# EAGLE design SolarBase731-v00 (EAGLE 5.10)
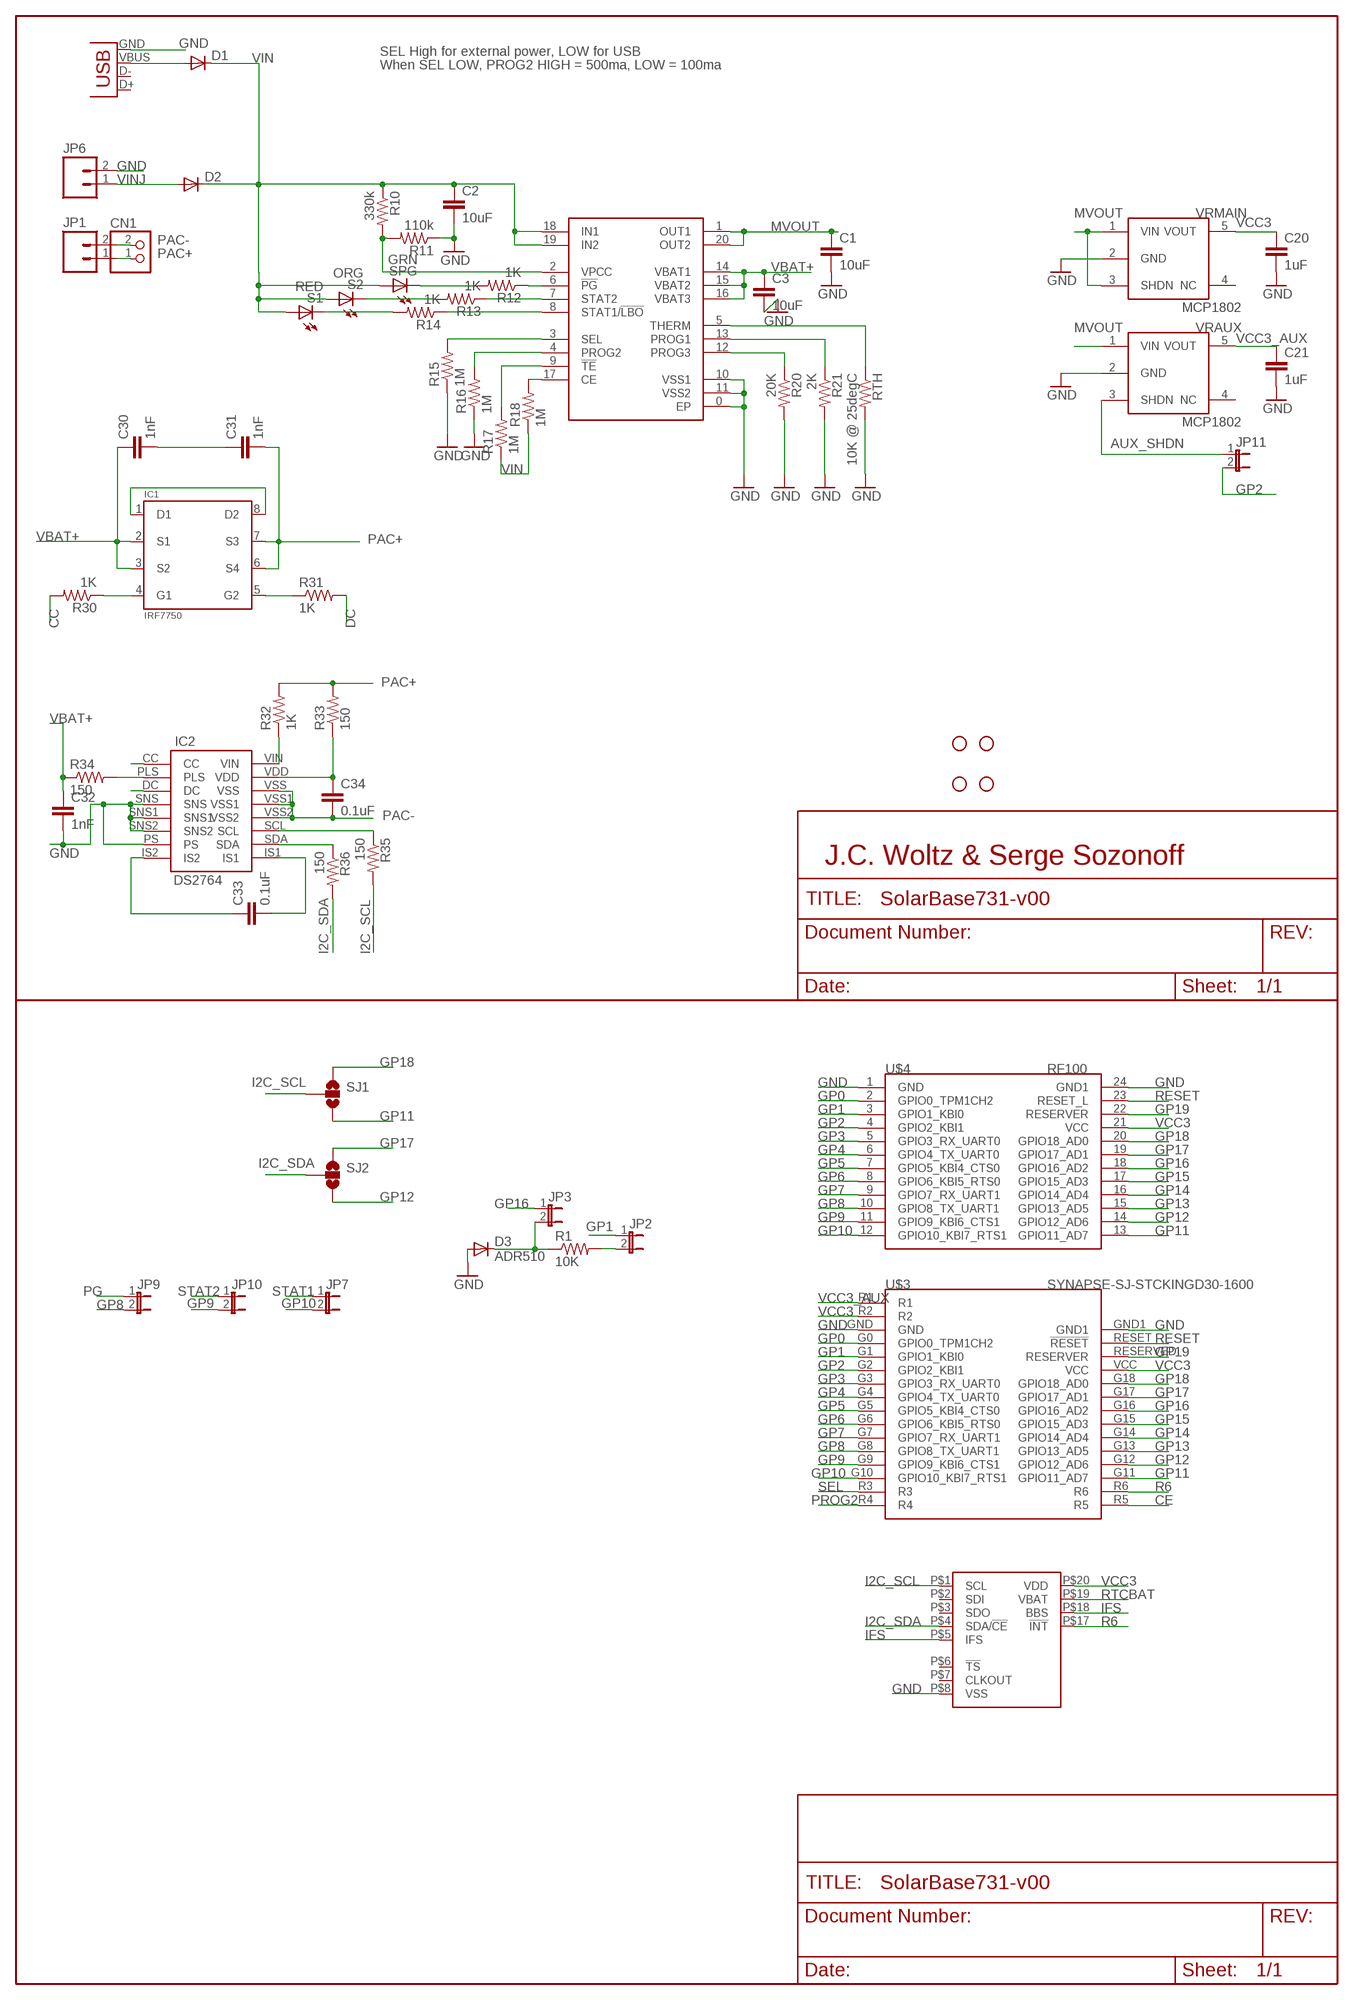
[diagram p0: schematic, sheet 1]

## Parts
C1  10uF  CAP1206  [1206]
C2  10uF  CAP1206  [1206]
C3  10uF  CAP1206  [1206]
C20  1uF  CAP0603-CAP  [0603-CAP]
C21  1uF  CAP0603-CAP  [0603-CAP]
C30  1nF  CAP0603-CAP  [0603-CAP]
C31  1nF  CAP0603-CAP  [0603-CAP]
C32  1nF  CAP0603-CAP  [0603-CAP]
C33  0.1uF  CAP0603-CAP  [0603-CAP]
C34  0.1uF  CAP0603-CAP  [0603-CAP]
CN1  JST_2PIN-THM-RA  [JST-PH-2-THM-RA]
D1  DIODESOD  [SOD-323]
D2  DIODESMA  [SMA-DIODE]
D3  ADR510  DIODESOT-23-3-ADR510  [SOT23-3]
IC1  IRF7750  [TSSOP8-4.4MM]
IC2  DS2764  [DS2764]
JP1  M02PTH  [1X02]
JP2  JUMPER-2SMD-NC  [SJ_2S]
JP3  JUMPER-2SMD-NC  [SJ_2S]
JP4  STAND-OFF  [STAND-OFF]
JP5  STAND-OFF  [STAND-OFF]
JP6  M023.5MM  [SCREWTERMINAL-3.5MM-2]
JP7  JUMPER-2SMD-NC  [SJ_2S]
JP9  JUMPER-2SMD-NC  [SJ_2S]
JP10  JUMPER-2SMD-NC  [SJ_2S]
JP11  JUMPER-2SMD-NC  [SJ_2S]
JP12  STAND-OFF  [STAND-OFF]
JP17  STAND-OFF  [STAND-OFF]
R1  10K  RESISTOR0603-RES  [0603-RES]
R10  330k  RESISTOR0603-RES  [0603-RES]
R11  110k  RESISTOR0603-RES  [0603-RES]
R12  1K  RESISTOR0603-RES  [0603-RES]
R13  1K  RESISTOR0603-RES  [0603-RES]
R14  1K  RESISTOR0603-RES  [0603-RES]
R15  1M  RESISTOR0603-RES  [0603-RES]
R16  1M  RESISTOR0603-RES  [0603-RES]
R17  1M  RESISTOR0603-RES  [0603-RES]
R18  1M  RESISTOR0603-RES  [0603-RES]
R20  20K  RESISTOR0603-RES  [0603-RES]
R21  2K  RESISTOR0603-RES  [0603-RES]
R30  1K  RESISTOR0603-RES  [0603-RES]
R31  1K  RESISTOR0603-RES  [0603-RES]
R32  1K  RESISTOR0603-RES  [0603-RES]
R33  150  RESISTOR0603-RES  [0603-RES]
R34  150  RESISTOR0603-RES  [0603-RES]
R35  150  RESISTOR0603-RES  [0603-RES]
R36  150  RESISTOR0603-RES  [0603-RES]
RTH  10K @ 25degC  RESISTOR0603-RES  [0603-RES]
S1  RED  LED0603  [LED-0603]
S2  ORG  LED0603  [LED-0603]
SJ1  SOLDERJUMPER_2WAYS  [SJ_3]
SJ2  SOLDERJUMPER_2WAYS  [SJ_3]
SPG  GRN  LED0603  [LED-0603]
U$1  PCF2129ASO20  [SO20W]
U$2  MCP73871  MCP73871QFNE  [QFN20]
U$3  SYNAPSE-SJ-STCKINGD30-1600  [SYNSJ-STACK]
U$4  SYNAPSEWIRELESS-RFENGINESTD  SYNAPSEWIRELESS-RFENGINESTDTHM  [SYNAPSERFENGINE-THM]
VRAUX  MCP1802  [SOT23-5]
VRMAIN  MCP1802  [SOT23-5]
X1  USBSMD  [USB-MINIB]

## Nets
!TE: R17.2 U$2.9(!TE)
AUX_SHDN: JP11.1 VRAUX.3(SHDN)
CC: IC2.CC R30.2
CE: R18.2 U$2.17(CE) U$3.R5
DC: IC2.DC R31.2
GND: C1.2 C2.2 C3.2 C20.2 C21.2 C32.2 D3.2(A) IC2.PS IC2.SNS IC2.SNS1 IC2.SNS2 JP6.2 R11.1 R15.1 R16.1 R20.2 R21.2 RTH.2 U$1.P$8(VSS) U$2.0(EP) U$2.10(VSS1) U$2.11(VSS2) U$3.GND U$3.GND1 U$4.1(GND) U$4.24(GND1) VRAUX.2(GND) VRMAIN.2(GND) X1.GND
GP0: U$3.G0(GPIO0_TPM1CH2) U$4.2(GPIO0_TPM1CH2)
GP1 [small_sig]: JP2.1 U$3.G1(GPIO1_KBI0) U$4.3(GPIO1_KBI0)
GP2 [small_sig]: JP11.2 U$3.G2(GPIO2_KBI1) U$4.4(GPIO2_KBI1)
GP3 [small_sig]: U$3.G3(GPIO3_RX_UART0) U$4.5(GPIO3_RX_UART0)
GP4 [small_sig]: U$3.G4(GPIO4_TX_UART0) U$4.6(GPIO4_TX_UART0)
GP5 [small_sig]: U$3.G5(GPIO5_KBI4_CTS0) U$4.7(GPIO5_KBI4_CTS0)
GP6 [small_sig]: U$3.G6(GPIO6_KBI5_RTS0) U$4.8(GPIO6_KBI5_RTS0)
GP7 [small_sig]: U$3.G7(GPIO7_RX_UART1) U$4.9(GPIO7_RX_UART1)
GP8 [small_sig]: JP9.2 U$3.G8(GPIO8_TX_UART1) U$4.10(GPIO8_TX_UART1)
GP9 [small_sig]: JP10.2 U$3.G9(GPIO9_KBI6_CTS1) U$4.11(GPIO9_KBI6_CTS1)
GP10 [small_sig]: JP7.2 U$3.G10(GPIO10_KBI7_RTS1) U$4.12(GPIO10_KBI7_RTS1)
GP11 [small_sig]: SJ1.3 U$3.G11(GPIO11_AD7) U$4.13(GPIO11_AD7)
GP12 [small_sig]: SJ2.3 U$3.G12(GPIO12_AD6) U$4.14(GPIO12_AD6)
GP13 [small_sig]: U$3.G13(GPIO13_AD5) U$4.15(GPIO13_AD5)
GP14 [small_sig]: U$3.G14(GPIO14_AD4) U$4.16(GPIO14_AD4)
GP15 [small_sig]: U$3.G15(GPIO15_AD3) U$4.17(GPIO15_AD3)
GP16 [small_sig]: JP3.1 U$3.G16(GPIO16_AD2) U$4.18(GPIO16_AD2)
GP17 [small_sig]: SJ2.1 U$3.G17(GPIO17_AD1) U$4.19(GPIO17_AD1)
GP18 [small_sig]: SJ1.1 U$3.G18(GPIO18_AD0) U$4.20(GPIO18_AD0)
GP19 [small_sig]: U$3.RESERVED(RESERVER) U$4.22(RESERVER)
I2C_SCL [small_sig]: R35.2 SJ1.2 U$1.P$1(SCL)
I2C_SDA [small_sig]: R36.2 SJ2.2 U$1.P$4(SDA/!CE)
IFS: U$1.P$5(IFS) U$1.P$18(BBS)
MVOUT: C1.1 U$2.1(OUT1) U$2.20(OUT2) VRAUX.1(VIN) VRMAIN.1(VIN) VRMAIN.3(SHDN)
N$1: IC1.1(D1) IC1.8(D2)
N$2: R12.2 SPG.C
N$3: D3.1(C) JP3.2 R1.1
N$4: JP2.2 R1.2
N$5: IC1.4(G1) R30.1
N$6: R13.2 S2.C
N$7: R14.2 S1.C
N$14: IC1.5(G2) R31.1
N$15: IC2.VIN R32.1
N$16: C33.2 IC2.IS1
N$17: IC2.SCL R35.1
N$18: C34.1 IC2.VDD R33.1
N$19: C30.2 C31.1
N$21: D1.2(A) X1.VBUS
N$23: R10.2 R11.2 U$2.2(VPCC)
N$24: C33.1 IC2.IS2
N$25: IC2.SDA R36.1
PAC+ [Vbat]: C31.2 CN1.1 IC1.6(S4) IC1.7(S3) JP1.1 R32.2 R33.2
PAC- [Vbat]: C34.2 CN1.2 IC2.VSS IC2.VSS1 IC2.VSS2 JP1.2
PG: JP9.1 R12.1 U$2.6(!PG)
PLS: IC2.PLS R34.2
PROG1: R21.1 U$2.13(PROG1)
PROG2: R16.2 U$2.4(PROG2) U$3.R4
PROG3: R20.1 U$2.12(PROG3)
R6: U$1.P$17(!INT) U$3.R6
RESET [small_sig]: U$3.RESET(!RESET) U$4.23(RESET_L)
RTCBAT: U$1.P$19(VBAT)
SEL: R15.2 U$2.3(SEL) U$3.R3
STAT1: JP7.1 R14.1 U$2.8(STAT1/!LBO)
STAT2: JP10.1 R13.1 U$2.7(STAT2)
THERM: RTH.1 U$2.5(THERM)
VBAT+ [Vbat]: C3.1 C30.1 C32.1 IC1.2(S1) IC1.3(S2) R34.1 U$2.14(VBAT1) U$2.15(VBAT2) U$2.16(VBAT3)
VCC3: C20.1 U$1.P$20(VDD) U$3.R2 U$3.VCC U$4.21(VCC) VRMAIN.5(VOUT)
VCC3_AUX: C21.1 U$3.R1 VRAUX.5(VOUT)
VIN: C2.1 D1.1(C) D2.C R10.1 R17.1 R18.1 S1.A S2.A SPG.A U$2.18(IN1) U$2.19(IN2)
VINJ: D2.A JP6.1
Unconnected: U$1.P$2(SDI) U$1.P$3(SDO) U$1.P$6(!TS) U$1.P$7(CLKOUT) VRAUX.4(NC) VRMAIN.4(NC) X1.D+ X1.D-

## Notes on the sheet
- SEL High for external power, LOW for USB
- When SEL LOW, PROG2 HIGH = 500ma, LOW = 100ma
- J.C. Woltz & Serge Sozonoff

## Library data of the parts
C1-C3 = SparkFun:CAP: Capacitor Standard 0603 ceramic capacitor, and 0.1" leaded capacitor.
C20 C21 C30-C34 = 0_jc-custom:CAP: Capacitor Standard 0603 ceramic capacitor, and 0.1" leaded capacitor.
CN1 = 0_jc-custom:JST_2PIN: JST 2-Pin Connectors of various flavors SMT-RA (S2B-PH-SM4) 4UConnector #17311 SMT (B2B-PH-SM4) THM-RA (S2B-PH) THM (B2B-PH)
D1 D2 = SparkFun:DIODE: Diode These are standard reverse protection diodes and small signal diodes. SMA package can handle up to about 1A. SOD-323 can handle about 200mA. What the SOD-323 package when ordering, there are some mfgs out there that are 5-pin packages.
D3 = 0_jc-modified:DIODE: Diode These are standard reverse protection diodes and small signal diodes. SMA package can handle up to about 1A. SOD-323 can handle about 200mA. What the SOD-323 package when ordering, there are some mfgs out there that are 5-pin packages.
IC1 = ssozonoff:IRF7750: HEXFET® power MOSFETs from International Rectifier utilize advanced processing techniques to achieve extremely low on-resistance per silicon area. This benefit, combined with the ruggedized device design, that International Rectifier is well known for, provides the designer with an extremely efficient and reliable device for battery and load management.
IC2 = ssozonoff:DS2764
JP1 JP6 = SparkFun:M02: Header 2 Standard 2-pin 0.1" header. Use with straight break away headers (SKU : PRT-00116), right angle break away headers (PRT-00553), swiss pins (PRT-00743), machine pins (PRT-00117), and female headers (PRT-00115). Molex polarized connector foot print use with SKU : PRT-08233 with associated crimp pins and housings.
JP2 JP3 JP7 JP9-JP11 = SparkFun:JUMPER-2: Jumper Basic 0.1" spaced jumper. Use with breakaway headers.
JP4 JP5 JP12 JP17 = SparkFun:STAND-OFF: Stand Off This is the mechanical footprint for a #4 phillips button head screw. Use the keepout ring to avoid running the screw head into surrounding components. SKU : PRT-00447
R1 R10-R18 R20 R21 R30-R36 RTH = 0_jc-custom:RESISTOR
S1 S2 SPG = 0_jc-custom:LED: LEDs Standard schematic elements and footprints for 5mm, 3mm, 1206, and 0603 sized LEDs. 5mm - Spark Fun Electronics SKU : COM-00529 (and others)
SJ1 SJ2 = SparkFun:SOLDERJUMPER_2WAY: Solder Jumper 2 way solder jumper
U$1 = 0_jc-custom:PCF2129A
U$2 = 0_jc-custom:MCP73871
U$3 = 0_jc-custom:SYNAPSE-SJ-STCKING: Standard layout for expansion modules using Synapse Wireless boards
U$4 = 0_jc-custom:SYNAPSEWIRELESS-RFENGINE
VRAUX VRMAIN = 0_jc-modified:MCP1802
X1 = 0_jc-custom:USB: USB Connectors USB-B-PTH is fully proven SKU : PRT-00139 USB-miniB is fully proven SKU : PRT-00587 USB-A-PCB is untested. USB-A-H is throughly reviewed, but untested. Spark Fun Electronics SKU : PRT-00437 USB-B-SMT is throughly reviewed, but untested. Needs silkscreen touching up. USB-A-S has not been used/tested USB-MB-H has not been used/tested

## Net classes
0 default: width 0.229 mm
1 Vbat: width 0.483 mm
2 small_sig: width 0.152 mm

## Board
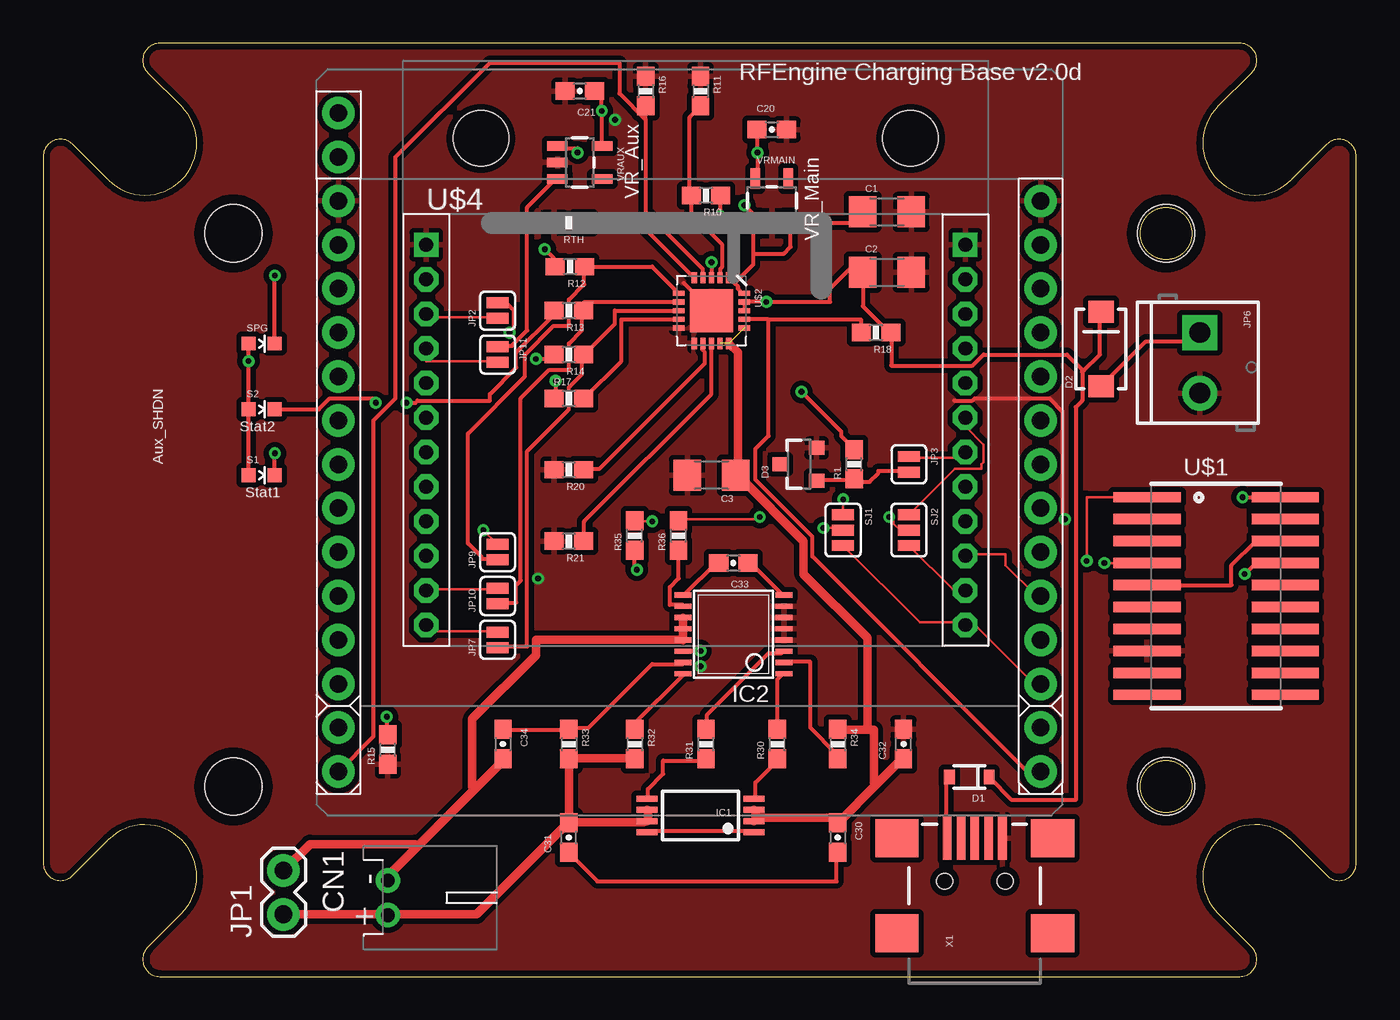
[diagram p1: board, top side]
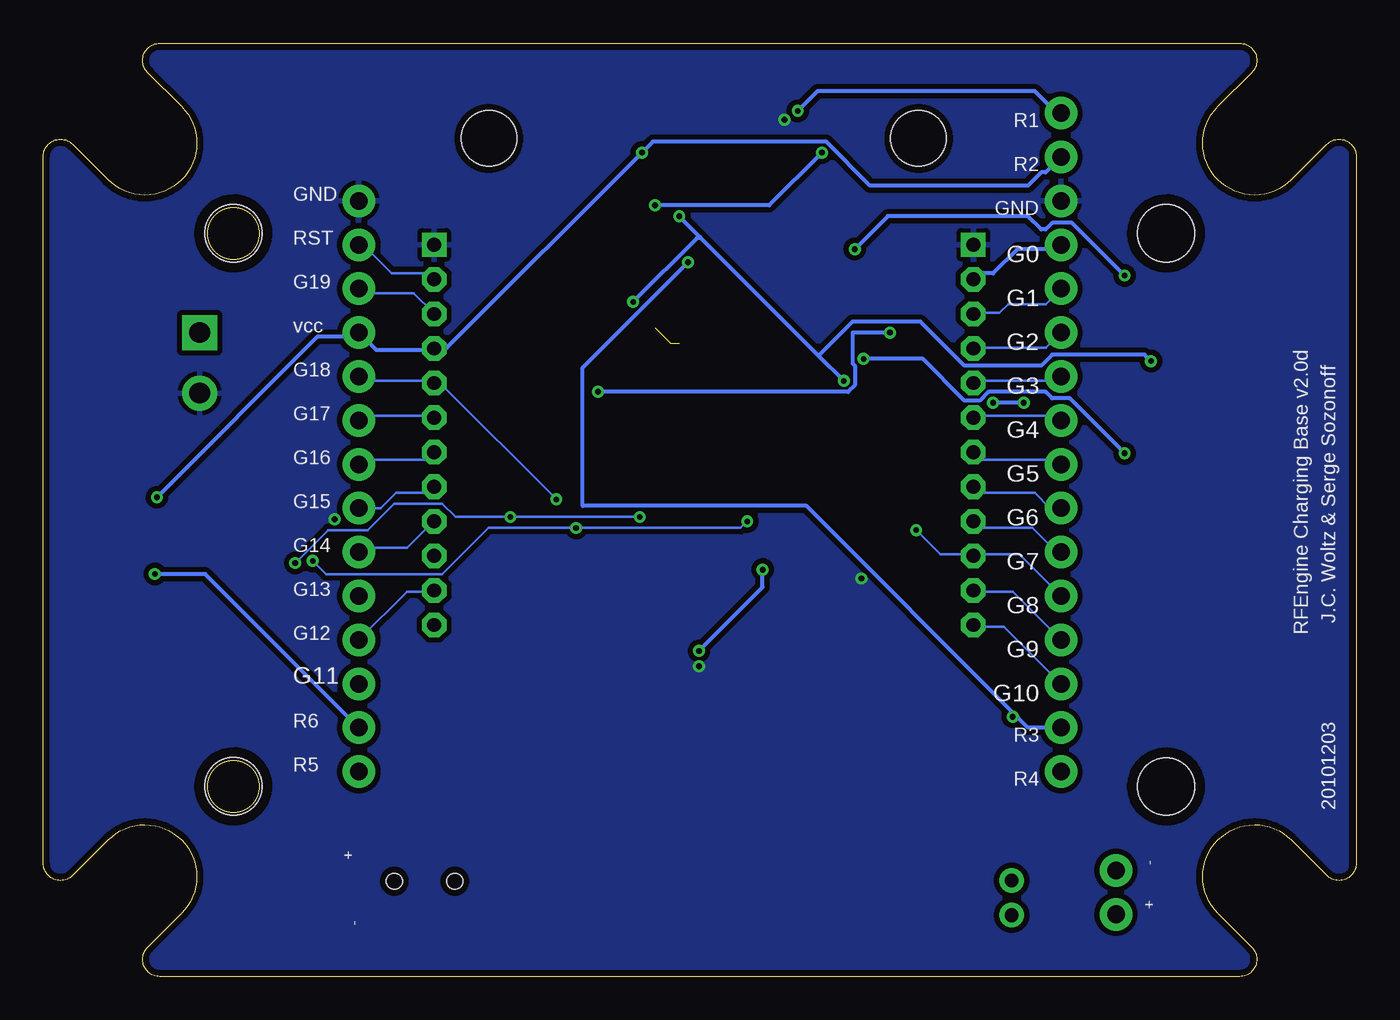
[diagram p2: board, bottom side, seen from below]

Size 76 x 54 mm. Coordinates in mm from the lower left corner, seen from the top.
Outline: 72.24,46.1 arc-180 68,50.34 69.95,52.29 arc135 69.24,54 6.75,54 arc135 6.05,52.29 8,50.34 arc-180 3.76,46.1 1.71,48.15 arc135 0,47.44 0,6.55 arc135 1.71,5.85 3.76,7.9 arc-180 8,3.66 6.05,1.71 arc135 6.75,0 69.24,0 arc135 69.95,1.71 68,3.66 arc-180 72.24,7.9 74.29,5.85 arc135 76,6.55 76,47.44 arc135 74.29,48.15 72.24,46.1
Outline: circle at 64.99,43 radius 1.5
Outline: circle at 64.99,11 radius 1.5
Copper layers (1*16): Top 0.0356mm / dielectric 1.5011mm / Bottom 0.0356mm
Design rules "LaenPCBOrder-JCModified": minimum track width 6mil, minimum drill 13mil, track to track 6mil, track to pad 6mil, pad to pad 6mil, via to via 6mil, smd to smd 6mil, copper to edge 15mil, drill to drill 6mil, minimum pad ring 12mil, minimum via ring 7mil, stop-mask expansion 4mil, vias tented up to drill 25mil, thermal gap 10mil

### Footprints (pad centres in the part's own frame; a part is rotated, then mirrored left to right if it is on the bottom)
1206 = smd 1.6 x 1.8: 1 -1.4,0; 2 1.4,0
0603-CAP = smd 1.1 x 1: 1 -0.85,0; 2 0.85,0
JST-PH-2-THM-RA = drill 0.8 pad 1.422 round: 1 1,0; 2 -1,0
SOD-323 = smd 0.63 x 0.83: 1 -1.15,0; 2 1.15,0
SMA-DIODE = smd 1.27 x 1.47: A -2.15,0; C 2.15,0
SOT23-3 = smd 0.8 x 0.9: 1 -0.95,-1; 2 0.95,-1; 3 0,1.1
TSSOP8-4.4MM = smd 1.2 x 0.35: 1 -3.1,0.975; 2 -3.1,0.325; 3 -3.1,-0.325; 4 -3.1,-0.975; 5 3.1,-0.975; 6 3.1,-0.325; 7 3.1,0.325; 8 3.1,0.975
DS2764 = smd 0.305 x 0.991: CC -2.275,-2.918; DC -0.975,-2.918; IS1 2.275,2.918; IS2 2.275,-2.918; PLS -1.625,-2.918; PS 1.625,-2.918; SCL -0.975,2.918; SDA 1.625,2.918; SNS -0.325,-2.918; SNS1 0.325,-2.918; SNS2 0.975,-2.918; VDD -1.625,2.918; VIN -2.275,2.918; VSS -0.325,2.918; VSS1 0.325,2.918; VSS2 0.975,2.918
1X02 = drill 1.016 pad 1.88 round: 1 0,0; 2 2.54,0
SJ_2S = smd 0.635 x 1.27: 1 -0.45,0; 2 0.45,0
STAND-OFF = hole 3.302: 0,0
SCREWTERMINAL-3.5MM-2 = drill 1.2 pad 2.032 square: 1 0,0 | drill 1.2 pad 2.032 round: 2 3.5,0
0603-RES = smd 1.1 x 1: 1 -0.85,0; 2 0.85,0
LED-0603 = smd 0.8 x 0.8: A 0,-0.75; C 0,0.75
SJ_3 = smd 0.635 x 1.27: 1 -0.889,0; 2 0,0; 3 0.889,0
SO20W = smd 0.6 x 3.9: P$1 -5.715,-4; P$2 -4.445,-4; P$3 -3.175,-4; P$4 -1.905,-4; P$5 -0.635,-4; P$6 0.635,-4; P$7 1.905,-4; P$8 3.175,-4; P$9 4.445,-4; P$10 5.715,-4; P$11 5.715,4; P$12 4.445,4; P$13 3.175,4; P$14 1.905,4; P$15 0.635,4; P$16 -0.635,4; P$17 -1.905,4; P$18 -3.175,4; P$19 -4.445,4; P$20 -5.715,4
QFN20 = smd 2.5 x 2.5: 0 0,0 | smd 0.65 x 0.3: 1 -1.9,1; 2 -1.9,0.5; 3 -1.9,0; 4 -1.9,-0.5; 5 -1.9,-1; 11 1.9,-1; 12 1.9,-0.5; 13 1.9,0; 14 1.9,0.5; 15 1.9,1 | smd 0.3 x 0.65: 6 -1,-1.9; 7 -0.5,-1.9; 8 0,-1.9; 9 0.5,-1.9; 10 1,-1.9; 16 1,1.9; 17 0.5,1.9; 18 0,1.9; 19 -0.5,1.9; 20 -1,1.9
SYNSJ-STACK = drill 1.016 pad 1.88 round: G0 0,-7.62; G1 0,-10.16; G2 0,-12.7; G3 0,-15.24; G4 0,-17.78; G5 0,-20.32; G6 0,-22.86; G7 0,-25.4; G8 0,-27.94; G9 0,-30.48; G10 0,-33.02; G11 40.64,-33.02; G12 40.64,-30.48; G13 40.64,-27.94; G14 40.64,-25.4; G15 40.64,-22.86; G16 40.64,-20.32; G17 40.64,-17.78; G18 40.64,-15.24; GND 0,-5.08; GND1 40.64,-5.08; R1 0,0; R2 0,-2.54; R3 0,-35.56; R4 0,-38.1; R5 40.64,-38.1; R6 40.64,-35.56; RESERVED 40.64,-10.16; RESET 40.64,-7.62; VCC 40.64,-12.7
SYNAPSERFENGINE-THM = drill 0.8 square: 1 0,0; 24 31.2,0 | drill 0.8 pad 1.422 octagon: 2 0,-2; 3 0,-4; 4 0,-6; 5 0,-8; 6 0,-10; 7 0,-12; 8 0,-14; 9 0,-16; 10 0,-18; 11 0,-20; 12 0,-22; 13 31.2,-22; 14 31.2,-20; 15 31.2,-18; 16 31.2,-16; 17 31.2,-14; 18 31.2,-12; 19 31.2,-10; 20 31.2,-8; 21 31.2,-6; 22 31.2,-4; 23 31.2,-2 | hole 3.2: 3.17,6.16; 28.03,6.16
SOT23-5 = smd 0.55 x 1.2: 1 -0.95,-1.3; 2 0,-1.3; 3 0.95,-1.3; 4 0.95,1.3; 5 -0.95,1.3
USB-MINIB = smd 2.5 x 0.5: D+ 2.5,0; D- 2.5,0.8; GND 2.5,-1.6; ID 2.5,-0.8; VBUS 2.5,1.6 | smd 2.2 x 2.5: GND@1 -3,-4.5; GND@2 -3,4.5; GND@3 2.5,4.5; GND@4 2.5,-4.5 | hole 0.9: 0,1.75; 0,-1.75

### Placement (x,y rotation side)
C1  48.84,44.24 0 top
C2  48.84,40.75 0 top
C3  38.68,29 180 top
C20  42.17,49.01 0 top
C21  31.06,51.23 180 top
C30  45.98,8.05 270 top
C31  30.42,8.05 90 top
C32  49.79,13.45 90 top
C33  39.95,23.92 180 top
C34  26.61,13.45 270 top
CN1  19.95,4.56 270 top
D1  53.6,11.54 180 top
D2  61.22,36.31 90 top
D3  43.76,29.64 90 top
IC1  38.04,9.32 180 top
IC2  39.95,19.8 90 top
JP1  13.91,3.6 90 top
JP2  26.3,38.53 90 top
JP3  50.11,29.64 270 top
JP4  64.99,43 0 top
JP5  11.01,43 0 top
JP6  66.94,37.26 270 top
JP7  26.3,19.48 90 top
JP9  26.3,24.56 90 top
JP10  26.3,22.02 90 top
JP11  26.3,35.99 270 top
JP12  64.99,11 0 top
JP17  11.01,11 0 top
R1  46.93,29.64 90 top
R10  38.36,45.2 180 top
R11  38.04,51.23 270 top
R12  30.49,41.07 180 top
R13  30.42,38.53 180 top
R14  30.42,35.99 180 top
R15  19.95,13.13 90 top
R16  34.87,51.23 270 top
R17  30.42,33.45 0 top
R18  48.2,37.26 180 top
R20  30.42,29.32 180 top
R21  30.42,25.19 180 top
R30  42.49,13.45 90 top
R31  38.36,13.45 90 top
R32  34.23,13.45 270 top
R33  30.42,13.45 270 top
R34  45.98,13.45 270 top
R35  34.23,25.51 90 top
R36  36.77,25.51 90 top
RTH  30.42,43.61 180 top
S1  12.64,29 270 top
S2  12.64,32.81 270 top
SJ1  46.3,25.83 270 top
SJ2  50.11,25.83 270 top
SPG  12.64,36.62 270 top
U$1  67.89,22.02 270 top
U$2  38.68,38.53 270 top
U$3  17.09,49.96 0 top
U$4  22.17,42.34 0 top
VRAUX  31.06,47.1 270 top
VRMAIN  42.17,44.88 0 top
X1  53.92,5.51 90 top

### Tracks (layer width: path | path; a pad name or v marks a point on that pad's centre or on a via)
!TE
  Top 0.229: U$2.9 33.47,38.02 33.47,35.61 31.31,33.45 R17.2
AUX_SHDN
  Top 0.229: VRAUX.3 29.66,46.15 28.01,44.5 28.01,37.38 27.12,36.5 26.36,36.5 JP11.1
CC
  Top 0.229: IC2.CC 42.74,17.45 42.49,17.19 42.49,14.4 R30.2
CE
  Top 0.229: 41.98,38.02 47.32,38.02 47.32,37.26 R18.2 | 41.98,38.02 U$2.17 | 41.98,38.02 41.98,31.29 41.22,30.53 41.22,28.75 44.52,25.45 44.52,24.3 56.97,11.86 U$3.R5
DC
  Top 0.229: IC2.DC 42.74,18.72 41.98,18.72 38.43,15.16 38.43,14.4 R31.2
GND  (via drill 0.33)
  Top 0.229: U$2.0 37.16,40.05 37.07,40.13 | v59.13,26.46 59,26.59 59,32.69 58.24,33.45 53.92,33.45 53.79,33.32 52.78,33.32 52.72,33.34
  other vias: 28.65,23.03 38.04,17.95 33.09,49.58
  pour Top (isolate 0.305): -0.69,0.43 -0.69,53.77 75.51,53.77 75.51,0.43
  pour Bottom (isolate 0.305): 0.58,53.77 0.58,0.43 75.51,0.43 75.51,53.77
GP0
  Bottom 0.229: U$3.G0 17.34,42.08 19.63,42.08 21.03,40.69 21.92,40.69 22.17,40.43 U$4.2
GP1
  Top 0.152: JP2.1 26.23,38.15 22.17,38.15 22.17,38.27 U$4.3
  Bottom 0.152: U$3.G1 17.98,38.91 20.14,38.91 20.65,38.4 22.17,38.4 U$4.3
GP2
  Top 0.152: JP11.2 26.23,35.61 22.17,35.61 22.17,36.24 U$4.4
  Bottom 0.152: U$3.G2 17.98,36.37 22.17,36.37 U$4.4
GP3
  Bottom 0.152: U$3.G3 17.34,34.46 22.17,34.46 U$4.5
GP4
  Bottom 0.152: U$3.G4 17.34,32.43 22.17,32.43 U$4.6
GP5
  Bottom 0.152: U$3.G5 17.34,29.89 21.79,29.89 22.17,30.27 U$4.7
GP6
  Bottom 0.152: U$3.G6 17.72,27.1 18.61,27.99 21.92,27.99 22.17,28.24 U$4.8
GP7
  Bottom 0.152: U$3.G7 17.34,24.56 18.74,25.95 21.79,25.95 U$4.9
GP8  (via drill 0.33)
  Top 0.152: v25.47,25.83 26.23,25.07 JP9.2
  Bottom 0.152: v25.47,25.83 24.07,24.43 22.17,24.43 | 22.17,24.43 U$4.10 22.17,24.43 | U$3.G8 19.5,24.43 22.17,24.43
GP9
  Top 0.152: JP10.2 26.23,22.4 22.17,22.4 U$4.11
  Bottom 0.152: U$3.G9 19.88,22.27 22.17,22.27 U$4.11
GP10
  Top 0.152: JP7.2 26.23,19.99 22.17,19.99 22.17,20.24 U$4.12
  Bottom 0.152: U$3.G10 20.39,20.24 22.17,20.24 U$4.12
GP11
  Top 0.152: SJ1.3 50.74,20.49 53.28,20.49 53.28,20.37 U$4.13 53.41,20.24 54.05,20.24 56.97,17.32 56.97,16.94 U$3.G11
GP12
  Top 0.152: SJ2.3 52.65,22.4 53.28,22.4 U$4.14
  Bottom 0.152: U$3.G12 54.94,22.27 53.41,22.27 U$4.14
GP13
  Top 0.152: U$3.G13 57.48,22.02 55.7,23.8 55.7,24.43 53.41,24.43 U$4.15
GP14
  Bottom 0.152: U$3.G14 57.48,24.81 54.94,24.81 53.41,26.34 U$4.16
GP15
  Bottom 0.152: U$3.G15 56.46,27.1 55.57,27.99 53.67,27.99 53.41,28.24 U$4.17
GP16
  Top 0.152: JP3.1 50.11,30.02 53.28,30.02 53.28,30.27 U$4.18
  Bottom 0.152: U$3.G16 57.48,29.89 53.79,29.89 53.41,30.27 U$4.18
GP17
  Top 0.152: SJ2.1 52.78,29.38 54.3,29.38 54.3,29.64 54.43,29.76 54.43,30.78 53.41,31.8 53.41,32.3 U$4.19
  Bottom 0.152: U$3.G17 57.48,32.43 53.41,32.43 U$4.19
GP18  (via drill 0.33)
  Top 0.152: SJ1.1 v46.3,27.61
  Bottom 0.152: v46.3,27.61 53.03,34.34 53.28,34.34 U$4.20 53.41,34.46 57.48,34.46 U$3.G18
GP19
  Bottom 0.152: U$3.RESERVED 57.48,39.54 54.55,39.54 53.41,38.4 U$4.22
I2C_SCL  (via drill 0.33)
  Top 0.152: v35.25,26.34 34.23,26.34 R35.2 | v45.16,25.95 46.3,25.95 SJ1.2 | v60.4,24.05 60.4,27.73 63.83,27.73 U$1.P$1
  Bottom 0.152: v35.25,26.34 35.63,25.95 v45.16,25.95 50.24,25.95 52.9,23.29 59.63,23.29 v60.4,24.05
I2C_SDA  (via drill 0.33)
  Top 0.152: v41.47,26.59 41.47,26.46 36.77,26.46 R36.2 | v48.97,26.59 49.22,26.34 49.22,26.21 49.6,25.83 SJ2.2 | v61.41,23.92 63.83,23.92 U$1.P$4
  Bottom 0.152: v41.47,26.59 v48.97,26.59 52.14,26.59 52.9,27.35 55.7,27.35 57.22,25.83 59.51,25.83 v61.41,23.92
IFS
  Top 0.229: U$1.P$5 63.95,22.65 68.78,22.65 68.78,23.8 70.18,25.19 71.83,25.19 U$1.P$18
MVOUT  (via drill 0.33)
  Top 0.229: C1.1 47.32,44.24 47.32,43.61 43.12,43.61 VRMAIN.3 43.12,43.48 43.25,43.35 43.25,42.21 42.87,41.83 41.09,41.83 | 40.01,40.11 39.7,40.43 U$2.1 | 40.01,40.11 40.2,39.92 40.2,39.8 40.46,39.54 U$2.20 | v30.93,47.67 30.93,47.93 29.79,47.93 VRAUX.1 | v40.58,44.62 41.22,43.99 41.22,43.61 VRMAIN.1 41.09,43.99 41.09,41.83 | 41.09,41.83 41.09,41.19 40.08,40.18 40.01,40.11
  Bottom 0.229: v30.93,47.67 33.98,44.62 v40.58,44.62
N$1
  Top 0.229: IC1.8 35,8.43 41.09,8.43 IC1.1
N$2  (via drill 0.33)
  Top 0.229: v13.41,40.56 13.41,36.62 SPG.C | v29.03,42.08 29.54,41.58 29.54,41.07 R12.2
  Bottom 0.229: v13.41,40.56 16.45,43.61 17.6,43.61 17.98,43.23 18.23,43.23 18.99,43.99 27.12,43.99 v29.03,42.08
N$3
  Top 0.229: 46.93,28.75 44.78,28.75 D3.1 | 46.93,28.75 R1.1 46.93,28.75 | 46.93,28.75 46.93,28.62 47.82,28.62 48.33,29.13 48.33,29.26 50.11,29.26 JP3.2
N$4  (via drill 0.33)
  Top 0.229: v43.89,33.83 46.17,31.54 46.17,31.29 46.93,30.53 R1.2 | v27,37.26 27.25,37.51 27.25,38.53 26.87,38.91 26.36,38.91 JP2.2
  Bottom 0.229: v43.89,33.83 29.41,33.83 29.03,34.21 29.03,35.35 29.15,35.48 29.15,37.26 v27,37.26
N$5
  Top 0.229: R30.1 42.49,12.49 41.22,11.22 41.22,10.33 IC1.4
N$6  (via drill 0.33)
  Top 0.229: v19.25,33.19 19.25,33.45 16.58,33.45 15.95,32.81 13.41,32.81 S2.C | v21.03,33.19 21.53,33.19 21.66,33.32 25.85,33.32 25.85,33.7 27.38,35.23 27.38,36.11 29.54,38.27 29.54,38.53 R13.2
  Bottom 0.229: v19.25,33.19 v21.03,33.19
N$7  (via drill 0.33)
  Top 0.229: v13.41,30.27 13.41,29 S1.C | v28.52,35.73 29.54,35.73 29.54,35.99 R14.2
  Bottom 0.229: v13.41,30.27 16.58,33.45 17.6,33.45 17.98,33.83 21.28,33.83 21.79,33.32 22.68,33.32 25.09,35.73 v28.52,35.73
N$14
  Top 0.229: R31.1 38.3,12.49 35.89,12.49 35.89,11.73 35,10.84 35,10.33 IC1.5
N$15
  Top 0.229: IC2.VIN 37.03,17.45 34.23,14.65 34.23,14.4 R32.1
N$16
  Top 0.229: IC2.IS1 37.16,22.14 38.93,23.92 39.06,23.92 C33.2
N$17  (via drill 0.33)
  Top 0.229: v38.04,18.84 37.16,18.84 IC2.SCL | v34.36,23.54 34.23,23.67 34.23,24.56 R35.1
  Bottom 0.229: v38.04,18.84 34.36,22.53 v34.36,23.54
N$18
  Top 0.229: IC2.VDD 37.03,18.08 35.25,18.08 31.57,14.4 30.42,14.4 R33.1 30.42,14.27 26.61,14.27 C34.1
N$19
  Top 0.229: C31.1 30.42,7.16 32.08,5.51 45.92,5.51 45.92,7.16 C30.2
N$21
  Top 0.229: D1.2 52.4,11.48 52.27,11.35 52.27,8.05 X1.VBUS
N$23
  Top 0.229: U$2.2 39.19,40.94 39.31,41.07 39.31,42.34 37.54,44.12 37.54,45.13 R10.2 37.41,45.26 37.41,49.7 38.04,50.34 R11.2
N$24
  Top 0.229: IC2.IS2 42.74,22.14 40.97,23.92 40.84,23.92 C33.1
N$25
  Top 0.229: IC2.SDA 37.03,21.51 36.27,21.51 36.27,22.53 36.77,23.03 36.77,24.56 R36.1
PAC+
  Top 0.483: IC1.6 35,9.57 35,9.06 IC1.7 34.74,8.94 30.55,8.94 C31.2 | C31.2 30.42,8.94 30.42,12.49 R33.2 30.55,12.62 34.23,12.62 R32.2 | JP1.1 19.88,3.6 CN1.1 20.14,3.6 25.09,3.6 30.3,8.81 C31.2
PAC-
  Top 0.483: IC2.VSS2 37.03,20.75 37.03,20.37 IC2.VSS1 IC2.VSS 36.77,19.48 28.52,19.48 28.52,18.59 24.84,14.91 24.84,10.97 24.96,10.84 | 21.66,7.54 20.01,5.89 20.01,5.63 CN1.2 | 21.66,7.54 24.96,10.84 | 24.96,10.84 26.61,12.49 C34.2 | JP1.2 15.44,7.67 21.53,7.67 21.66,7.54
PG
  Top 0.229: U$2.6 36.77,39.54 35.25,41.07 31.44,41.07 R12.1 31.31,41.07 31.31,40.05 30.42,39.16 30.42,37.64 29.54,37.64 27.88,35.99 27.88,34.72 24.58,31.42 24.58,25.07 25.34,24.3 25.34,24.18 26.23,24.18 JP9.1
PLS
  Top 0.229: IC2.PLS 42.87,18.21 44.39,18.21 44.39,14.4 45.92,12.87 45.92,12.62 R34.2
PROG1
  Top 0.229: U$2.13 38.68,33.7 31.31,26.34 31.31,25.19 R21.1
PROG2
  Top 0.229: 34.87,49.58 34.87,50.34 R16.2 | 34.87,49.58 34.87,44.24 38.17,40.94 U$2.4 | U$3.R4 19.12,13.89 19.12,32.18 20.39,33.45 20.39,47.42 25.85,52.88 33.35,52.88 33.35,51.1 34.87,49.58
PROG3
  Top 0.229: U$2.12 38.17,36.24 38.3,36.11 38.3,35.48 32.2,29.38 31.31,29.38 R20.1
R6  (via drill 0.33)
  Top 0.229: v69.54,23.29 70.18,23.92 71.83,23.92 U$1.P$17
  Bottom 0.229: U$3.R6 66.62,23.29 v69.54,23.29
RESET
  Bottom 0.152: U$3.RESET 57.48,42.34 55.82,40.69 53.67,40.69 53.41,40.43 U$4.23
SEL  (via drill 0.33)
  Top 0.229: v38.68,41.32 U$2.3 | v19.88,15.03 19.88,14.02 R15.2
  Bottom 0.229: v38.68,41.32 44.78,35.23 44.78,27.22 31.82,27.22 19.69,15.1 | 19.69,15.1 18.99,14.4 U$3.R3 | v19.88,15.03 19.76,15.03 19.69,15.1
STAT1
  Top 0.229: U$2.8 33.09,38.53 33.09,37.77 31.31,35.99 R14.1 31.19,35.99 31.19,34.84 30.42,34.08 30.42,32.81 28.01,30.4 28.01,19.1 26.36,19.1 JP7.1
STAT2
  Top 0.229: U$2.7 31.31,39.04 31.31,38.53 R13.1 31.19,38.53 31.19,37.38 30.42,36.62 30.42,35.1 29.28,35.1 27.63,33.45 27.63,22.91 27.38,22.65 27.38,21.64 26.36,21.64 JP10.1
THERM
  Top 0.229: U$2.5 37.66,40.43 34.49,43.61 31.31,43.61 RTH.1
VBAT+  (2 unrouted)
  Top 0.483: U$2.15 39.7,36.62 40.2,36.11 40.2,29 C3.1 40.33,28.88 44.01,25.19 44.01,23.29 47.7,19.6 47.7,14.4 47.7,14.27 | 41.22,9.19 41.22,9.57 IC1.3 | 41.22,9.19 41.22,9.06 IC1.2 | 48.2,11.1 49.73,12.62 C32.1 | 48.2,11.1 46.05,8.94 C30.1 45.79,9.06 45.79,9.19 41.35,9.19 41.22,9.19 | 47.7,14.27 48.08,14.27 48.08,11.22 48.2,11.1 | 47.7,14.27 46.05,14.27 R34.1
VCC3  (via drill 0.33)
  Top 0.229: C20.1 41.35,48.94 v41.35,47.67 41.35,46.27 VRMAIN.5 | v69.41,27.73 71.83,27.73 U$1.P$20
  Bottom 0.229: U$3.R2 17.98,46.53 18.23,46.53 18.99,45.77 28.14,45.77 30.68,48.31 40.71,48.31 v41.35,47.67 52.65,36.37 53.28,36.37 U$4.21 53.41,36.24 56.71,36.24 U$3.VCC 57.6,37 60.14,37 v69.41,27.73
VCC3_AUX  (via drill 0.33)
  Top 0.229: C21.1 31.95,51.23 32.33,50.85 v32.33,50.08 32.33,48.05 VRAUX.5
  Bottom 0.229: v32.33,50.08 31.19,51.23 18.61,51.23 17.34,49.96 U$3.R1
VIN  (via drill 0.33)
  Top 0.229: 60.21,35.03 61.16,35.99 61.16,38.4 D2.C | 60.21,35.03 60.14,34.97 60.14,33.32 59.76,32.94 59.76,10.21 56.08,10.21 54.81,11.48 D1.1 | U$2.18 40.58,38.91 U$2.19 v41.85,39.04 45.54,39.04 45.54,39.8 46.68,40.94 47.32,40.94 47.32,40.81 C2.1 47.44,40.69 47.44,38.78 48.97,37.26 R18.1 49.09,37.26 49.09,35.35 53.79,35.35 54.43,35.99 59.25,35.99 60.14,35.1 60.21,35.03 | S2.A S1.A | S2.A | S2.A v11.88,35.61 SPG.A | v29.66,34.46 29.66,33.45 R17.1 | v39.19,43.99 39.19,45.13 R10.1
  Bottom 0.229: 37.98,42.78 v39.19,43.99 | 31.12,35.92 37.98,42.78 | 31.12,35.92 v29.66,34.46 | v11.88,35.61 12.26,35.99 17.6,35.99 18.23,35.35 22.68,35.35 25.22,37.89 29.15,37.89 31.06,35.99 31.12,35.92 | v41.85,39.04 38.17,42.72 38.04,42.72 37.98,42.78
VINJ
  Top 0.229: D2.A 61.29,34.21 63.83,36.75 66.87,36.75 66.87,37.26 JP6.1

### Text on the board
tPlace: RFEngine Charging Base v2.0d | VR_Aux | VR_Main | Stat2 | Aux_SHDN | Stat1
bPlace: R1 | R2 | GND | GND | G0 | RST | G1 | G19 | G2 | vcc | G3 | G18 | G4 | G17 | G5 | G16 | G6 | G15 | G7 | G14 | G8 | G13 | J.C. Woltz & Serge Sozonoff | RFEngine Charging Base v2.0d | G9 | G12 | G10 | G11 | R3 | R6 | R4 | R5 | 20101203 | - | + | + | -